# Altium schematic sheet Sunfish_ECU_Sensor_RevA.SchDoc
size A3; _PRJ_TITLE: PROJECT TITLE; _SHT_TITLE: Sheet; _REV: A; PageSetup: Record=PageOptions|CenterHorizontal=True|CenterVertical=True|PrintScale=0.71|XCorrection=1.00|YCorrection=1.00|PrintKind=0|BorderSize=5000000|LeftOffset=0|BottomOffset=0|Orientation=2|PaperLength=1000|PaperWidth=1000|Scale=100|PaperSource=258|PrintQuality=600|MediaType=1|DitherType=10|PaperKind=A3 (297x420mm)|PrintScaleMode=1
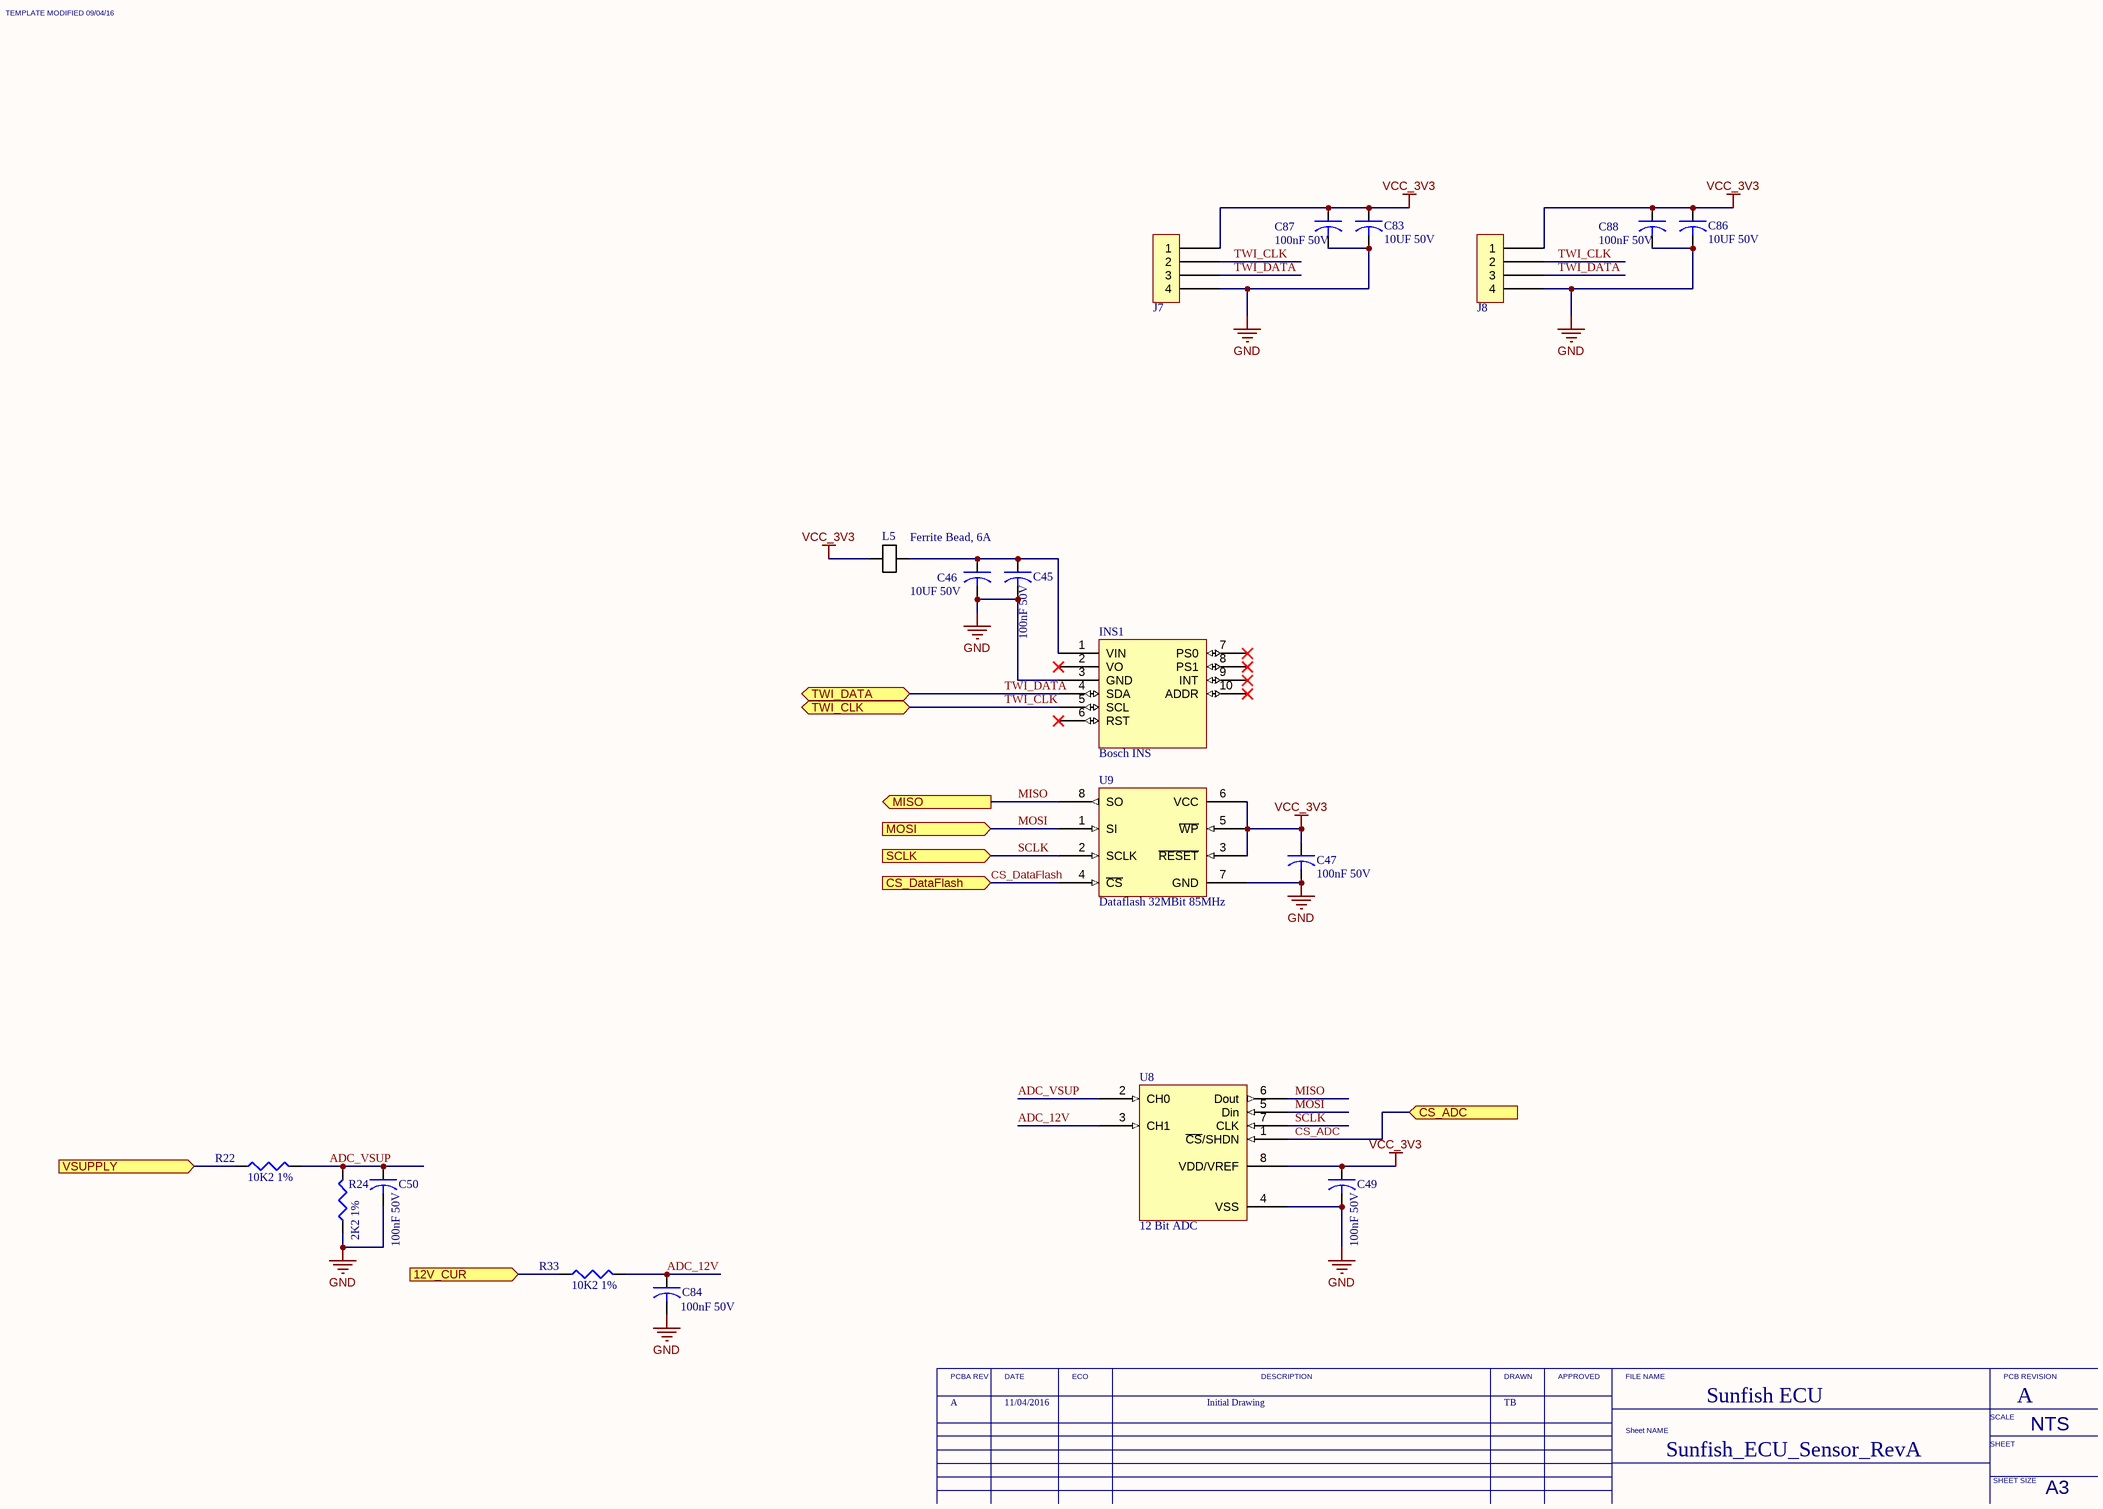
[diagram p0: Sunfish_ECU_Sensor_RevA.SchDoc]

## Parts
C45  100nF 50V  [0603]
C46  10UF 50V  [1206]
C47  100nF 50V  [0603]
C49  100nF 50V  [0603]
C50  100nF 50V  [0603]
C83  10UF 50V  [1206]
C84  100nF 50V  [0603]
C86  10UF 50V  [1206]
C87  100nF 50V  [0603]
C88  100nF 50V  [0603]
INS1  Bosch INS  [IC_INC_BNO055]
J7  4 Positions Header, Shrouded Connector 0.049" (1.25mm) Through Hole Tin  [DF13-4P-1.25DSA]  (value not drawn)
J8  4 Positions Header, Shrouded Connector 0.049" (1.25mm) Through Hole Tin  [DF13-4P-1.25DSA]  (value not drawn)
L5  Ferrite Bead, 6A  [1806]
R22  10K2 1%  [0603]
R24  2K2 1%  [0603]
R33  10K2 1%  [0603]
U8  12 Bit ADC  [SO-8]
U9  Dataflash 32MBit 85MHz  [SOIC127P800X216-8M]

## Ports
12V_CUR (in), CS_ADC (in), CS_DataFlash (in), MISO (out), MOSI (in), SCLK (in), TWI_CLK (bidir), TWI_DATA (bidir), VSUPPLY (in)

## Nets
GND: C45.2 C46.2 C47.2 C49.2 C50.2 C83.2 C84.2 C86.2 C87.2 C88.2 INS1.3(GND) J7.4 J8.4 R24.1 U8.4(VSS) U9.7(GND)
VCC_3V3: C47.1 C49.1 C83.1 C86.1 C87.1 C88.1 J7.1 J8.1 L5.1 U8.8(VDD/VREF) U9.3(~{RESET}) U9.5(~{WP}) U9.6(VCC)
12V_CUR: R33.1 ; port 12V_CUR
ADC_12V: C84.1 R33.2 U8.3(CH1)
ADC_VSUP: C50.1 R22.2 R24.2 U8.2(CH0)
CS_ADC: U8.1(~{CS}/SHDN) ; port CS_ADC
CS_DataFlash: U9.4(~{CS}) ; port CS_DataFlash
MISO: U8.6(Dout) U9.8(SO) ; port MISO
MOSI: U8.5(Din) U9.1(SI) ; port MOSI
SCLK: U8.7(CLK) U9.2(SCLK) ; port SCLK
TWI_CLK: INS1.5(SCL) J7.2 J8.2 ; port TWI_CLK
TWI_DATA: INS1.4(SDA) J7.3 J8.3 ; port TWI_DATA
VSUPPLY: R22.1 ; port VSUPPLY
NetC45_1: C45.1 C46.1 INS1.1(VIN) L5.2

Not connected (* = marked no-connect by the designer): INS1 2(VO)* 6(RST)* 7(PS0)* 8(PS1)* 9(INT)* 10(ADDR)*

## Notes on the sheet
- A
- 11/04/2016
- Initial Drawing
- TB
- Sunfish_ECU_Sensor_RevA
- Sunfish ECU
- TEMPLATE MODIFIED 09/04/16
- PCBA REV
- DATE
- ECO
- DESCRIPTION
- DRAWN
- APPROVED
- FILE NAME
- PCB REVISION
- Sheet NAME
- SCALE
- SHEET
- NTS
- SHEET SIZE
- A3

## Library data of the parts
C45 C47 C49 C50 C84 C87 C88 = CAP_100NF_50V_10%_0603: CAP CER 100nF 50V 10% X7R 0603; Manufacturer: Murata; Manufacturer P/N: GRM188R71H104KA93D
C46 C83 C86 = CAP_10UF_50V_10%_1206: CAP CER 10UF 50V 10% X5R 1206; Manufacturer: Murata; Manufacturer P/N: GRM31CR61H106KA12L
INS1 = IC_INS_BNO055
J7 J8 = CON_4_Pos_Header: Manufacturer: Hirose Electric Co Ltd; Manufacturer P/N: DF13-4P-1.25DSA
L5 = IND_FERRITE_ BLM41PG600SN1L: Manufacturer: MURATA; Manufacturer P/N: BLM41PG600SN1L
R22 R33 = RES_10K2_1%_0603: Resistor, 10K2, 1%, 0603; Manufacturer: Yageo; Manufacturer P/N: RC0603FR-0710K2L
R24 = RES_2K2_1%_0603: Resistor, 2K2, 1%, 0603; Manufacturer: Bourns Inc; Manufacturer P/N: CR0603-FX-2201ELF
U8 = IC_ADC_MCP3202: MCP3202, 12 Bit, 2 CH ADC; Manufacturer: Microchip; Manufacturer P/N: MCP3202
U9 = IC_Dataflash_32MBit: IC DATAFLASH 32MB 85MHZ 8SOIC; Manufacturer: Adesto Technologies; Manufacturer P/N: AT45DB321E-SHF-T